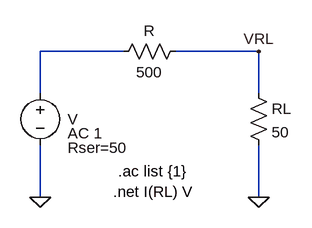
[diagram p0: schematic net_analysis.asc]
net_analysis.asc, the LTspice schematic file:
Version 4
SHEET 1 880 680
WIRE 208 320 80 320
WIRE 416 320 288 320
WIRE 80 384 80 320
WIRE 416 384 416 320
WIRE 80 544 80 464
WIRE 416 544 416 464
FLAG 80 544 0
FLAG 416 544 0
FLAG 416 320 VRL
SYMBOL res 304 304 R90
WINDOW 0 0 56 VBottom 2
WINDOW 3 32 56 VTop 2
SYMATTR InstName R
SYMATTR Value 500
SYMBOL voltage 80 368 R0
WINDOW 0 42 56 Left 2
WINDOW 123 42 78 Left 2
WINDOW 39 42 100 Left 2
SYMATTR InstName V
SYMATTR Value2 AC 1
SYMATTR Value ""
SYMATTR SpiceLine Rser=50
SYMBOL res 400 368 R0
SYMATTR InstName RL
SYMATTR Value 50
TEXT 200 504 Left 2 !.ac list {1}
TEXT 192 536 Left 2 !.net I(RL) V

The netlist it stands for:
* net_analysis.asc
R VRL N001 500
V N001 0 AC 1 Rser=50
RL VRL 0 50
.ac list {1}
.net I(RL) V
.backanno
.end